# EAGLE design I2CBB-R1 (EAGLE 7.3.0)
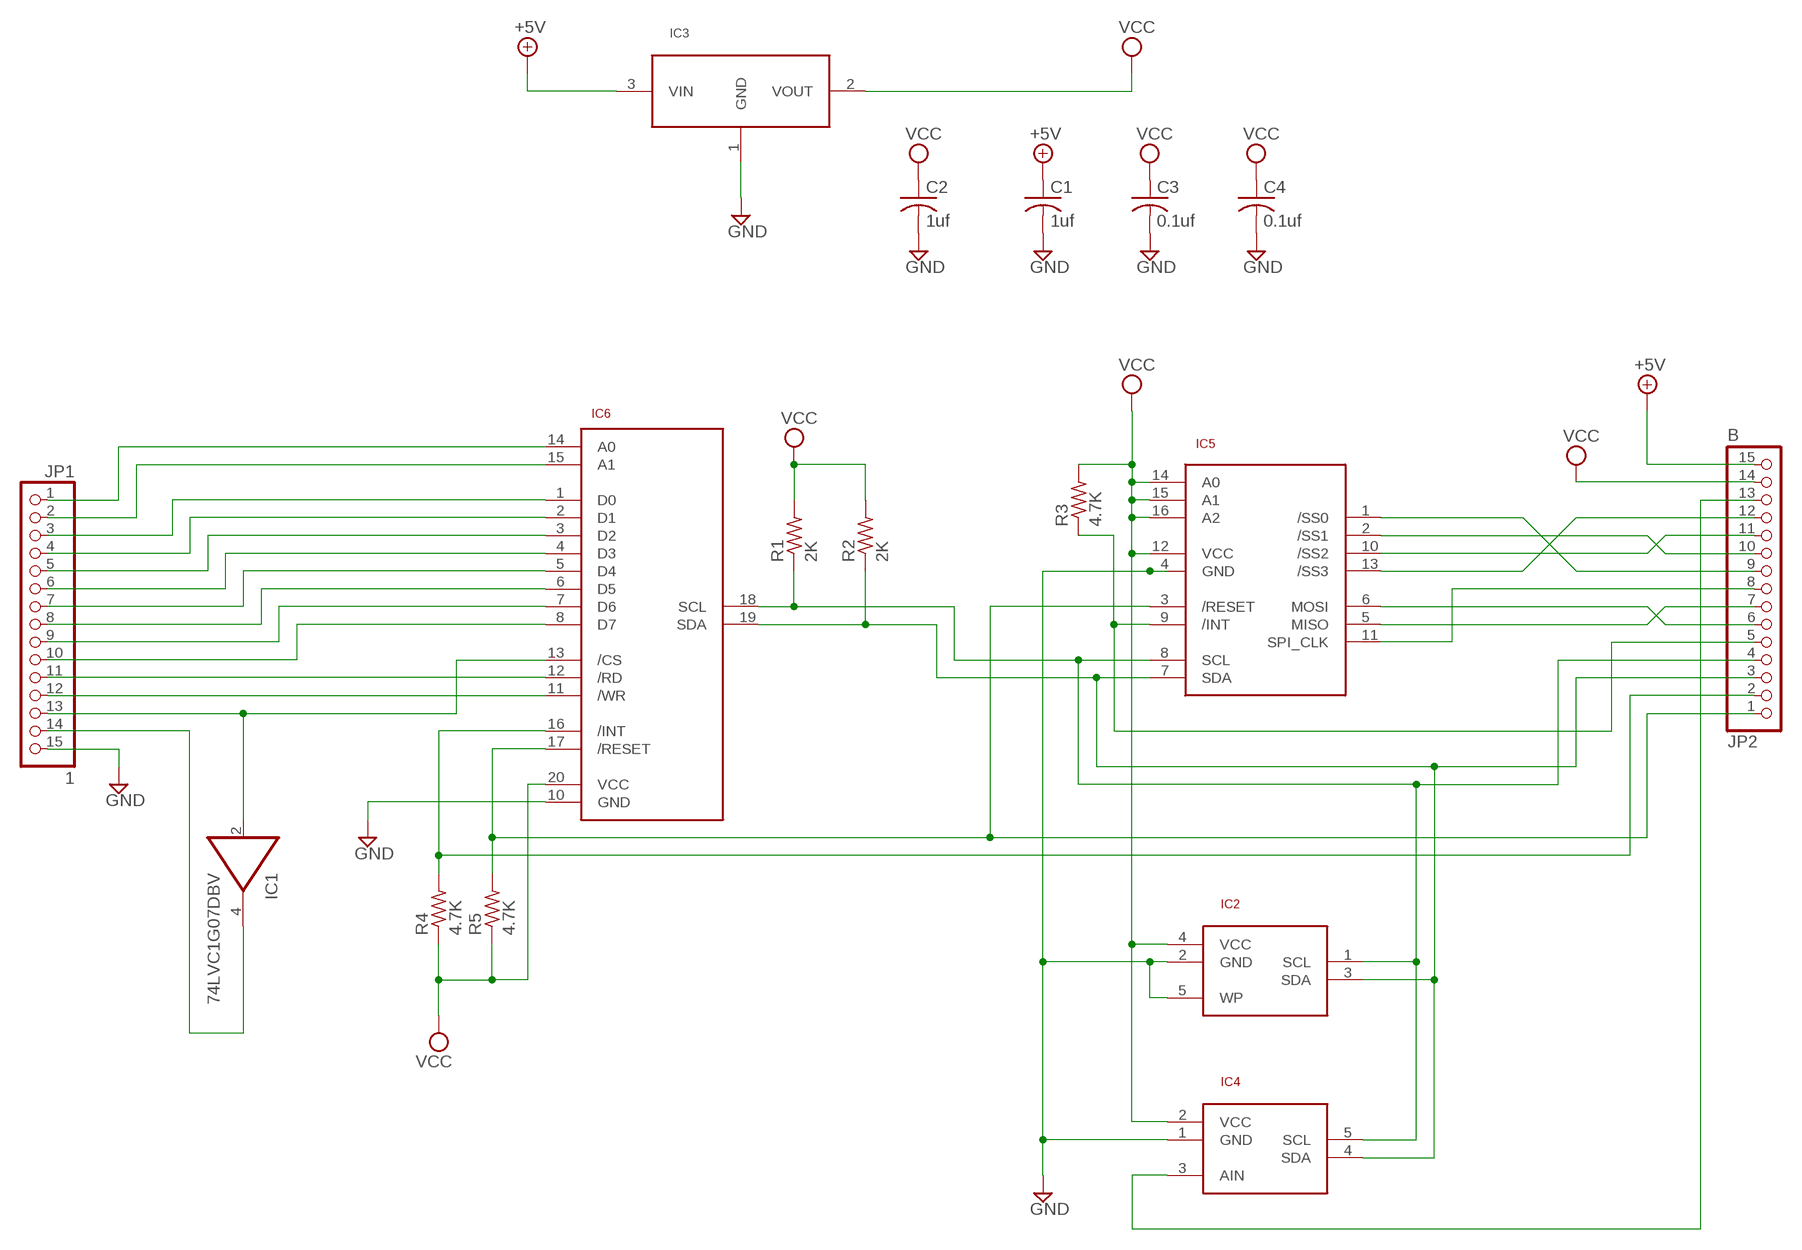
[diagram p0: schematic, sheet 1]

## Parts
C1  1uf  C-USC0603  [C0603]
C2  1uf  C-USC0603  [C0603]
C3  0.1uf  C-USC0603  [C0603]
C4  0.1uf  C-USC0603  [C0603]
IC1  74LVC1G07DBV  [SOT23-5]
IC2  24AA64T  [SOT23-5]
IC3  MCP1700T  [SOT23]
IC4  MCP3221  [SOT23-5]
IC5  SC18IS602  [TSSOP16]
IC6  PCA9665  [TSSOP20]
JP1  1  PINHD-1X15  [1X15]
JP2  B  PINHD-1X15  [1X15]
R1  2K  R-US_R0603  [R0603]
R2  2K  R-US_R0603  [R0603]
R3  4.7K  R-US_R0603  [R0603]
R4  4.7K  R-US_R0603  [R0603]
R5  4.7K  R-US_R0603  [R0603]

## Nets
+5V [power]: C1.1 IC3.3(VIN) JP2.15
/INTI2C: IC6.16(/INT) JP2.2 R4.2
AIN: IC4.3(AIN) JP2.13
GND [power]: C1.2 C2.2 C3.2 C4.2 IC2.2(GND) IC2.5(WP) IC3.1(GND) IC4.1(GND) IC5.4(GND) IC6.10(GND) JP1.15
N$1: IC1.2(I) IC6.13(/CS) JP1.13
N$2: IC1.4(O) JP1.14
N$3: IC6.11(/WR) JP1.12
N$4: IC6.12(/RD) JP1.11
N$5: IC6.14(A0) JP1.1
N$6: IC6.15(A1) JP1.2
N$7: IC6.1(D0) JP1.3
N$8: IC6.2(D1) JP1.4
N$9: IC6.3(D2) JP1.5
N$10: IC6.4(D3) JP1.6
N$11: IC6.5(D4) JP1.7
N$12: IC6.6(D5) JP1.8
N$13: IC6.7(D6) JP1.9
N$14: IC6.8(D7) JP1.10
N$17: IC5.9(/INT) JP2.5 R3.1
N$18: IC5.10(/SS2) JP2.11
N$19: IC5.2(/SS1) JP2.10
N$20: IC5.1(/SS0) JP2.9
N$21: IC5.13(/SS3) JP2.12
N$22: IC5.5(MISO) JP2.7
N$23: IC5.6(MOSI) JP2.6
N$24: IC5.11(SPI_CLK) JP2.8
RESET: IC5.3(/RESET) IC6.17(/RESET) JP2.1 R5.2
SCL: IC2.1(SCL) IC4.5(SCL) IC5.8(SCL) IC6.18(SCL) JP2.4 R1.1
SDA: IC2.3(SDA) IC4.4(SDA) IC5.7(SDA) IC6.19(SDA) JP2.3 R2.1
VCC [power]: C2.1 C3.1 C4.1 IC2.4(VCC) IC3.2(VOUT) IC4.2(VCC) IC5.12(VCC) IC5.14(A0) IC5.15(A1) IC5.16(A2) IC6.20(VCC) JP2.14 R1.2 R2.2 R3.2 R4.1 R5.1

## Power pins joined to a net without a drawn wire
GND: IC1.3(GND)
VCC: IC1.5(VCC)

## Library data of the parts
C1-C4 = resistor:C-US: CAPACITOR, American symbol
IC1 = 74xx-little-de:74*1G07: Single Buffer/Driver With Open-Drain Output
IC2 = parts:24AA64T: 64K I2C™ Serial EEPROM Microchip 400khz 1.7-3.3v
IC3 = parts:MCP1700T: Microchip MCP1700T-3302E/TT Voltage - Input Up to 6V Voltage - Output 3.3V Current - Output 250mA Voltage - Dropout (Typical) 0.178V @ 250mA
IC4 = parts:MCP3221: 12-Bit A/D Converter With I2C Interface Microchip 400khz 2.7v-5.5v
IC5 = parts:SC18IS602: IC BRIDGE SPI/I2C 16-TSSOP
IC6 = parts:PCA9665: IC CNTRLR PARALLEL/I2C 20TSSOP
JP1 JP2 = pinhead:PINHD-1X15: PIN HEADER
R1-R5 = resistor:R-US_: RESISTOR, American symbol

## Board
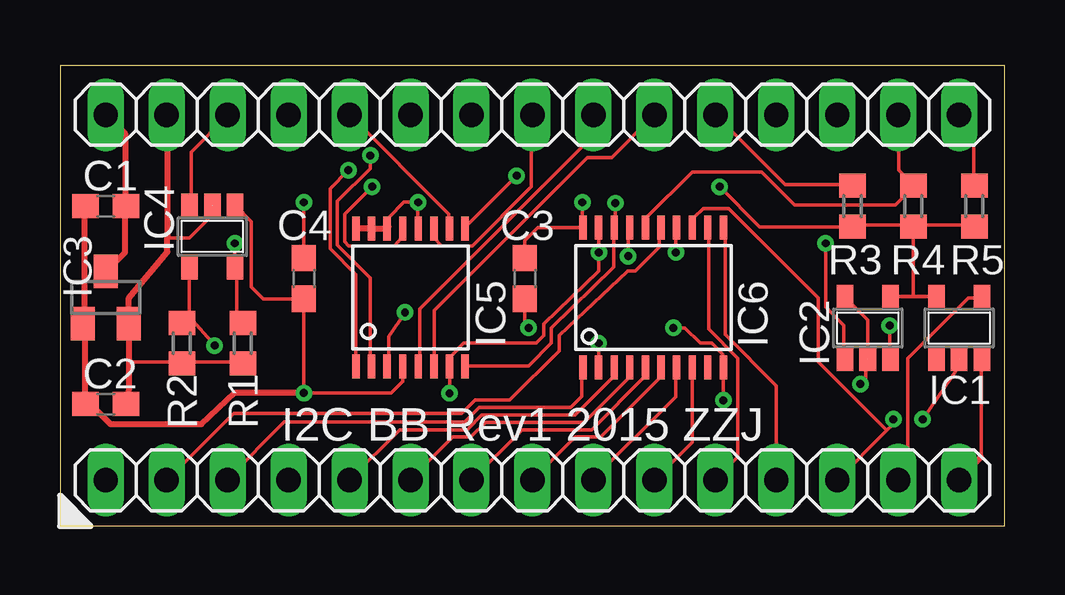
[diagram p1: board, top side]
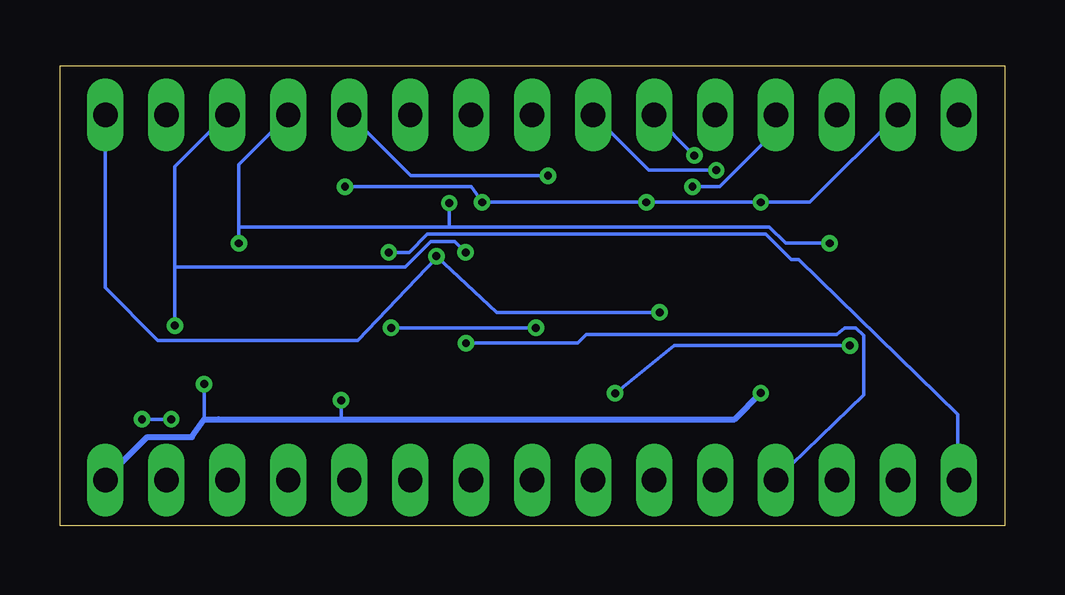
[diagram p2: board, bottom side, seen from below]

Size 39.36 x 19.2 mm. Coordinates in mm from the lower left corner, seen from the top.
Outline: 0,0 39.36,0 39.36,19.2 0,19.2 0,0
Copper layers (1*16): Top 0.0356mm / dielectric 1.5011mm / Bottom 0.0356mm
Design rules "LaenPCBOrder": minimum track width 6mil, minimum drill 13mil, track to track 6mil, track to pad 6mil, pad to pad 6mil, via to via 6mil, smd to smd 6mil, copper to edge 15mil, drill to drill 6mil, minimum pad ring 7mil, minimum via ring 7mil, stop-mask expansion 3mil, vias tented up to drill 0mil, thermal gap 10mil

### Footprints (pad centres in the part's own frame; a part is rotated, then mirrored left to right if it is on the bottom)
C0603 = smd 1.1 x 1: 1 -0.85,0; 2 0.85,0
SOT23-5 = smd 0.69 x 0.99: 1 -0.95,-1.29; 2 0,-1.29; 3 0.95,-1.29; 4 0.95,1.3; 5 -0.95,1.3
SOT23 = smd 1 x 1.4: 1 -0.95,-1.1; 2 0.95,-1.1; 3 0,1.1
TSSOP16 = smd 0.991 x 0.305: 1 -2.875,2.275; 2 -2.875,1.625; 3 -2.875,0.975; 4 -2.875,0.325; 5 -2.875,-0.325; 6 -2.875,-0.975; 7 -2.875,-1.625; 8 -2.875,-2.275; 9 2.875,-2.275; 10 2.875,-1.625; 11 2.875,-0.975; 12 2.875,-0.325; 13 2.875,0.325; 14 2.875,0.975; 15 2.875,1.625; 16 2.875,2.275
TSSOP20 = smd 0.305 x 0.991: 1 -2.975,-2.918; 2 -2.325,-2.918; 3 -1.675,-2.918; 4 -1.025,-2.918; 5 -0.375,-2.918; 6 0.275,-2.918; 7 0.925,-2.918; 8 1.575,-2.918; 9 2.225,-2.918; 10 2.875,-2.918; 11 2.875,2.918; 12 2.225,2.918; 13 1.575,2.918; 14 0.925,2.918; 15 0.275,2.918; 16 -0.375,2.918; 17 -1.025,2.918; 18 -1.675,2.918; 19 -2.325,2.918; 20 -2.975,2.918
1X15 = drill 1.016 long: 1 -17.78,0; 2 -15.24,0; 3 -12.7,0; 4 -10.16,0; 5 -7.62,0; 6 -5.08,0; 7 -2.54,0; 8 0,0; 9 2.54,0; 10 5.08,0; 11 7.62,0; 12 10.16,0; 13 12.7,0; 14 15.24,0; 15 17.78,0
R0603 = smd 1 x 1.1: 1 -0.85,0; 2 0.85,0

### Placement (x,y rotation side)
C1  1.91,13.34 180 top
C2  1.91,5.08 180 top
C3  19.37,10.32 270 top
C4  10.16,10.32 270 top
IC1  37.47,8.26 0 top
IC2  33.66,8.26 0 top
IC3  1.91,9.53 0 top
IC4  6.35,12.06 180 top
IC5  14.61,9.53 90 top
IC6  24.76,9.53 0 top
JP1  19.68,1.91 0 top
JP2  19.68,17.14 180 top
R1  7.62,7.62 270 top
R2  5.08,7.62 270 top
R3  33.02,13.34 270 top
R4  35.56,13.34 90 top
R5  38.1,13.34 90 top

### Tracks (layer width: path | path; a pad name or v marks a point on that pad's centre or on a via)
+5V
  Top 0.254: IC3.3 1.96,10.64 2.72,11.4 2.72,13.31 C1.1 2.72,13.46 2.72,16.36 1.96,17.12 JP2.15
/INTI2C
  Top 0.152: IC6.16 24.43,12.47 24.43,12.85 26.34,14.76 29.23,14.76 30.61,13.39 34.8,13.39 35.56,14.15 R4.2 35.56,14.22 34.95,14.83 34.95,17.12 JP2.2
AIN
  Top 0.152: IC4.3 5.46,13.39 5.46,15.6 6.99,17.12 JP2.13
GND  (via drill 0.33)
  Top 0.152: IC2.2 33.66,8.59 32.74,9.5 | 38.38,2.87 38.38,6.91 | 33.58,6.91 33.58,6.15 v33.35,5.92 | 7.37,13.31 7.98,12.7 7.98,9.96 8.46,9.47 C4.2 | 19.37,9.84 C3.2 19.37,8.41 v19.53,8.26 | v25.56,8.26 26.04,8.26 26.67,7.62 27.15,7.62 27.62,7.14 27.62,6.62 IC6.10 v27.64,5.24 | C4.2 10.16,8.57 | IC5.4 14.29,6.64 14.29,6.03 13.79,5.54 v10.16,5.54 C4.2
  Top 0.254: 32.74,9.5 IC2.5 | 38.38,2.87 37.47,1.96 JP1.15 | 38.38,6.91 IC1.3 | IC6.10 | 33.58,6.91 IC2.2 | C1.2 1.04,13.31 1.04,8.51 IC3.1 0.97,8.36 1.04,8.28 1.04,5.08 C2.2 1.12,5 1.35,5 2.11,4.24 5.89,4.24 7.3,5.56 10.14,5.56 v10.16,5.54 | 7.37,13.31 IC4.1
  Bottom 0.152: 33.35,4.43 v33.35,5.92 | v19.53,8.26 v25.56,8.26 | v27.64,5.24 27.64,4.45
  Bottom 0.254: JP1.15 37.47,1.96 35.71,3.71 33.86,3.71 33.35,4.43 32.75,4.45 27.64,4.45 11.25,4.45 v10.16,5.54
N$1  (via drill 0.33)
  Top 0.152: IC1.2 37.47,6.68 v35.94,4.45 | v34.72,4.45 34.72,4.24 34.46,3.98 | JP1.13 34.46,3.98 | 34.46,3.98 31.6,6.83 31.6,9.5 27.86,13.23 26.8,13.23 26.42,12.85 26.42,12.47 IC6.13
  Bottom 0.152: v34.72,4.45 v35.94,4.45
N$2
  Top 0.152: IC1.4 38.38,9.5 37.85,9.5 35.33,6.99 35.33,2.34 34.95,1.96 JP1.14
N$3
  Top 0.152: JP1.12 29.84,5.84 27.71,7.98 27.71,12.39 IC6.11
N$4
  Top 0.152: IC6.12 27.03,12.39 27.03,8.2 28.24,6.99 28.24,2.87 27.33,1.96 JP1.11
N$5  (via drill 0.33)
  Top 0.152: v25.66,11.4 25.65,11.56 25.65,12.39 IC6.14
  Bottom 0.152: v25.66,11.4 24.82,11.4 24.05,12.17 9.96,12.17 8.89,11.11 8.57,11.11 1.96,4.64 1.96,1.96 JP1.1
N$6
  Top 0.152: IC6.15 24.97,12.39 24.97,11.63 23.97,10.64 23.65,10.64 20.8,7.94 20.8,7.3 18.73,5.26 17.3,5.26 16.74,4.7 7.24,4.7 JP1.2 4.47,1.96
N$7
  Top 0.152: 21.77,6.6 IC6.1 21.75,6.57 21.75,5.4 21.27,4.95 17.46,4.95 16.86,4.34 9.35,4.34 6.99,1.96 JP1.3
N$8  (via drill 0.33)
  Top 0.152: IC6.2 v22.44,7.62
  Bottom 0.152: JP1.4 9.5,1.96 5.87,5.46 5.87,7.94 6.19,8.26 6.67,8.26 6.99,7.98 17.42,7.98 17.78,7.62 v22.44,7.62
N$9
  Top 0.152: IC6.3 23.06,6.6 23.06,6.22 21.46,4.62 17.58,4.62 16.97,4.01 14.15,4.01 12.09,1.96 JP1.5
N$10
  Top 0.152: IC6.4 23.67,6.6 23.67,6.15 21.84,4.32 17.73,4.32 17.12,3.71 16.36,3.71 14.61,1.96 JP1.6
N$11
  Top 0.152: JP1.7 19.25,4.01 22.15,4.01 24.36,6.22 24.36,6.6 IC6.5
N$12
  Top 0.152: IC6.6 24.97,6.6 24.97,6.15 22.53,3.71 21.46,3.71 19.71,1.96 JP1.8
N$13
  Top 0.152: IC6.7 25.65,6.6 25.65,5.38 22.22,1.96 JP1.9
N$14
  Top 0.152: JP1.10 26.34,3.48 IC6.8
N$17  (via drill 0.33)
  Top 0.152: v19.02,14.61 16.89,12.47 IC5.9 | JP2.5 30.23,14.22 32.97,14.22 R3.1
  Bottom 0.152: v19.02,14.61 24.74,14.61 27.25,17.12 JP2.5
N$18
  Top 0.152: JP2.11 16.2,13.01 16.2,12.47 IC5.10
N$19  (via drill 0.33)
  Top 0.152: v12.93,15.44 12.93,14.91 11.56,13.54 11.56,11.71 12.93,10.34 12.93,6.68 IC5.2
  Bottom 0.152: v12.93,15.44 14.61,17.12 JP2.10
N$20  (via drill 0.33)
  Top 0.152: v12.01,14.83 11.25,14.07 11.25,11.56 12.32,10.49 12.32,6.68 IC5.1
  Bottom 0.152: v12.01,14.83 14.83,14.83 JP2.9
N$21  (via drill 0.33)
  Top 0.152: v13.01,14.15 11.86,13.01 11.86,11.86 12.04,11.67 13.92,11.67 14.22,12.01 14.22,12.39 IC5.13
  Bottom 0.152: v13.01,14.15 11.86,14.15 9.58,16.43 9.58,17.12 JP2.12
N$22
  Top 0.152: JP2.7 22.22,16.28 14.99,9.04 14.99,6.68 IC5.5
N$23
  Top 0.152: JP2.6 22.99,15.37 21.97,15.37 15.6,8.99 15.6,6.68 IC5.6
N$24
  Top 0.152: IC5.11 15.6,12.39 15.6,12.01 15.9,11.67 17.17,11.67 19.63,14.15 19.63,17.12 JP2.8
RESET  (via drill 0.33)
  Top 0.152: R5.2 38.08,14.22 38.08,16.51 37.47,17.12 JP2.1 | v14.38,8.9 13.69,7.9 13.69,6.68 IC5.3 | v23.67,11.25 23.67,12.39 IC6.17
  Bottom 0.152: v14.38,8.9 21.16,8.9 v23.67,11.25 23.67,11.18 26.95,7.74 35.27,7.74 37.47,9.93 JP2.1
SCL  (via drill 0.33)
  Top 0.152: IC5.8 16.89,6.68 19.54,6.68 20.48,7.62 20.48,8.26 23.06,10.79 23.06,12.39 IC6.18 23.14,12.47 v23.14,13.46 | R1.1 7.6,8.51 7.37,8.74 7.37,10.72 IC4.5 7.29,10.79 v7.29,11.79 | v31.9,11.79 31.9,9.12 32.66,8.36 32.66,6.99 IC2.1
  Bottom 0.152: 31.9,12.47 31.9,15.06 29.84,17.12 JP2.4 | 31.9,12.47 v31.9,11.79 | v7.29,11.79 9.12,11.79 9.8,12.47 23.14,12.47 | 31.9,12.47 23.14,12.47 | 23.14,12.47 v23.14,13.46
SDA  (via drill 0.33)
  Top 0.152: v34.57,8.35 34.57,6.99 IC2.3 | IC4.4 5.38,10.72 5.38,8.81 5.08,8.51 R2.1 5.38,8.74 v6.45,7.52 | 16.28,6.68 IC5.7 | IC6.19 22.45,12.43 v22.45,11.4 22.45,10.64 20.16,8.41 20.16,7.94 19.84,7.62 16.83,7.62 16.28,7.06 16.23,7.01 IC5.7 | v16.23,5.53 IC5.7
  Bottom 0.152: 34.57,10.79 34.57,14.99 32.44,17.12 JP2.3 | 34.57,10.79 v34.57,8.35 | v6.45,7.52 13.77,7.52 v16.23,5.53 | 34.57,10.79 24.97,10.79 23.9,11.86 22.91,11.86 v22.45,11.4
VCC  (via drill 0.33)
  Top 0.152: 5.16,6.83 7.6,6.83 | 6.3,13.31 6.3,12.93 5.38,12.01 4.47,12.01 | 36.47,9.58 35.56,9.58 | 35.56,9.58 34.65,9.58 | 35.56,12.55 33.05,12.55 | 35.64,12.55 38.08,12.55 | R4.1 35.56,9.58 | 14.91,12.47 14.91,12.85 v14.92,13.49 14.33,13.49 13.69,12.85 13.69,12.47 | v21.77,13.49 21.77,12.47 | 32.89,12.47 29.16,12.47 v27.48,14.15 | 5.08,6.99 4.7,6.83 2.87,6.83 | IC6.20 19.9,12.44 19.37,11.91 C3.1 | C4.1 v10.16,13.49
  Top 0.254: 7.6,6.83 R1.2 | 5.16,6.83 R2.2 4.7,6.83 | 6.3,13.31 IC4.2 | 34.65,9.58 IC2.4 | 36.47,9.58 IC1.5 | 33.05,12.55 R3.2 32.89,12.47 | 35.56,12.55 R4.1 35.64,12.55 | 38.08,12.55 R5.1 | IC5.16 12.39,12.39 12.93,12.39 IC5.15 13.08,12.39 13.61,12.39 IC5.14 13.69,12.47 | 14.91,12.47 IC5.12 | 21.77,12.47 IC6.20 | JP2.14 4.47,17.12 4.47,12.01 4.47,11.43 2.87,9.5 2.87,8.43 IC3.2 2.87,8.36 2.87,6.83 2.87,5.71 C2.1
  Bottom 0.152: JP2.14 8.13,13.49 v10.16,13.49 v14.92,13.49 v21.77,13.49 22.22,14.15 v27.48,14.15

### Text on the board
tNames: I2C BB Rev1 2015 ZZJ